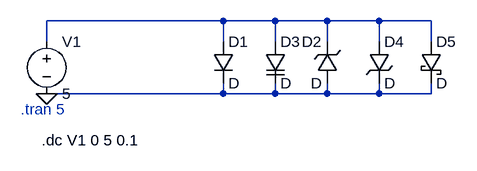
[diagram p0: schematic Dioden_sim.asc]
Dioden_sim.asc, the LTspice schematic file:
Version 4.1
SHEET 1 880 680
WIRE 320 96 48 96
WIRE 400 96 320 96
WIRE 480 96 400 96
WIRE 560 96 480 96
WIRE 640 96 560 96
WIRE 48 128 48 96
WIRE 320 128 320 96
WIRE 400 128 400 96
WIRE 480 128 480 96
WIRE 560 128 560 96
WIRE 640 128 640 96
WIRE 320 208 320 192
WIRE 320 208 48 208
WIRE 400 208 400 192
WIRE 400 208 320 208
WIRE 480 208 480 192
WIRE 480 208 400 208
WIRE 560 208 560 192
WIRE 560 208 480 208
WIRE 640 208 640 192
WIRE 640 208 560 208
FLAG 48 208 0
SYMBOL voltage 48 112 R0
WINDOW 123 0 0 Left 0
WINDOW 39 0 0 Left 0
SYMATTR InstName V1
SYMATTR Value 5
SYMBOL diode 304 128 R0
SYMATTR InstName D1
SYMBOL zener 496 192 R180
WINDOW 0 24 64 Left 2
WINDOW 3 24 0 Left 2
SYMATTR InstName D2
SYMBOL varactor 384 128 R0
SYMATTR InstName D3
SYMBOL TVSdiode 544 128 R0
SYMATTR InstName D4
SYMBOL schottky 624 128 R0
SYMATTR InstName D5
TEXT 8 232 Left 2 ;.tran 5
TEXT 40 280 Left 2 !.dc V1 0 5 0.1

The netlist it stands for:
* Dioden_sim.asc
V1 N001 0 5
D1 N001 0 D
D2 0 N001 D
D3 N001 0 D
D4 N001 0 D
D5 N001 0 D
.model D D
.lib standard.dio
* .tran 5
.dc V1 0 5 0.1
.backanno
.end